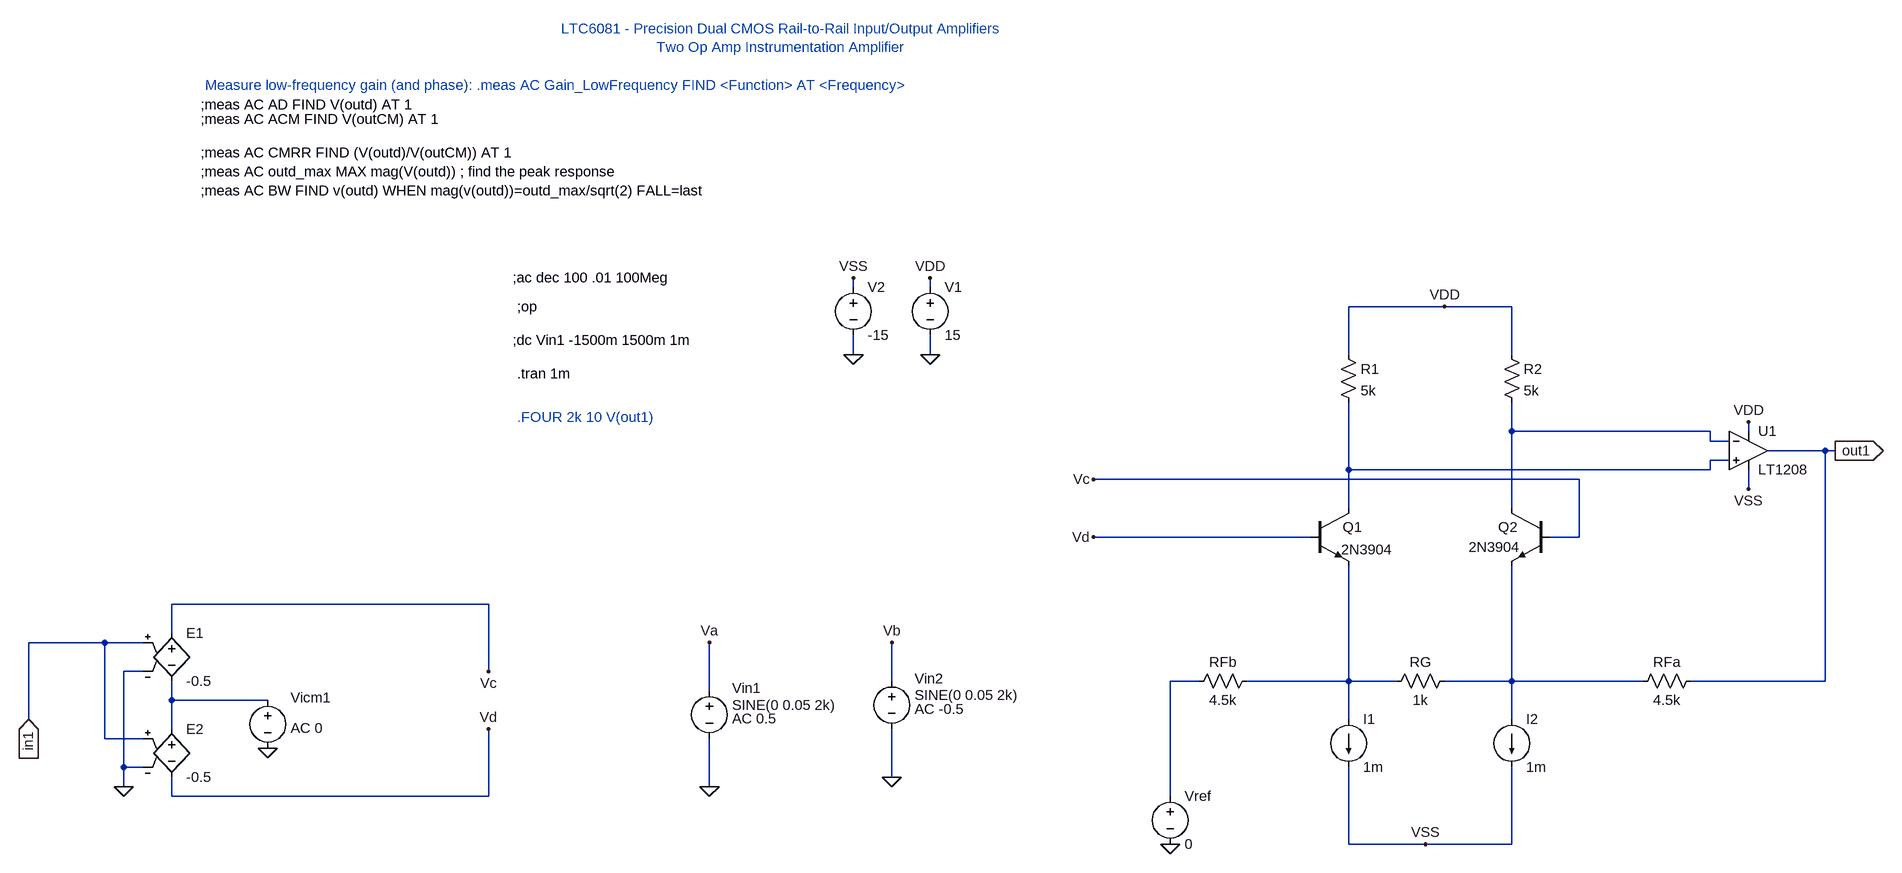
[diagram p0: schematic Etaj1.asc]
Etaj1.asc, the LTspice schematic file:
Version 4
SHEET 1 3624 1836
WIRE -3136 -272 -3136 -288
WIRE -3008 -272 -3008 -288
WIRE -2064 -240 -2224 -240
WIRE -1952 -240 -2064 -240
WIRE -3136 -160 -3136 -192
WIRE -3008 -160 -3008 -192
WIRE -2224 -160 -2224 -240
WIRE -1952 -160 -1952 -240
WIRE -1952 -32 -1952 -80
WIRE -1488 -32 -1952 -32
WIRE -1424 -32 -1424 -48
WIRE -1488 -16 -1488 -32
WIRE -1456 -16 -1488 -16
WIRE -1296 0 -1392 0
WIRE -1280 0 -1296 0
WIRE -1456 16 -1488 16
WIRE -2224 32 -2224 -80
WIRE -1488 32 -1488 16
WIRE -1488 32 -2224 32
WIRE -1840 48 -2736 48
WIRE -1424 64 -1424 32
WIRE -2224 96 -2224 32
WIRE -1952 96 -1952 -32
WIRE -2288 144 -2736 144
WIRE -1840 144 -1840 48
WIRE -1840 144 -1888 144
WIRE -3744 256 -4272 256
WIRE -4272 304 -4272 256
WIRE -4384 320 -4512 320
WIRE -4320 320 -4384 320
WIRE -4320 368 -4352 368
WIRE -3744 368 -3744 256
WIRE -3072 384 -3072 320
WIRE -2560 384 -2608 384
WIRE -2224 384 -2224 192
WIRE -2224 384 -2480 384
WIRE -2144 384 -2224 384
WIRE -1952 384 -1952 192
WIRE -1952 384 -2064 384
WIRE -1600 384 -1952 384
WIRE -1296 384 -1296 0
WIRE -1296 384 -1520 384
WIRE -3376 400 -3376 320
WIRE -4272 416 -4272 384
WIRE -4112 416 -4272 416
WIRE -4512 448 -4512 320
WIRE -2224 448 -2224 384
WIRE -1952 448 -1952 384
WIRE -4272 464 -4272 416
WIRE -4384 480 -4384 320
WIRE -4320 480 -4384 480
WIRE -4352 528 -4352 368
WIRE -4320 528 -4352 528
WIRE -3072 544 -3072 464
WIRE -4352 560 -4352 528
WIRE -3376 560 -3376 480
WIRE -4272 576 -4272 544
WIRE -3744 576 -3744 464
WIRE -3744 576 -4272 576
WIRE -2608 576 -2608 384
WIRE -2224 656 -2224 528
WIRE -2096 656 -2224 656
WIRE -1952 656 -1952 528
WIRE -1952 656 -2096 656
FLAG -3008 -160 0
FLAG -3008 -288 VDD
FLAG -3136 -160 0
FLAG -3136 -288 VSS
FLAG -1424 -48 VDD
FLAG -1424 64 VSS
FLAG -2064 -240 VDD
FLAG -2096 656 VSS
FLAG -3376 560 0
FLAG -3072 544 0
FLAG -2608 656 0
FLAG -3376 320 Va
FLAG -3072 320 Vb
FLAG -4352 560 0
FLAG -4112 496 0
FLAG -3744 368 Vc
FLAG -3744 464 Vd
FLAG -2736 48 Vc
FLAG -2736 144 Vd
FLAG -4512 448 in1
IOPIN -4512 448 In
FLAG -1280 0 out1
IOPIN -1280 0 Out
DATAFLAG -2224 -32 ""
DATAFLAG -1952 -48 ""
DATAFLAG -2224 336 ""
DATAFLAG -1952 304 ""
DATAFLAG -1296 112 ""
SYMBOL voltage -3008 -288 R0
WINDOW 123 0 0 Left 2
WINDOW 39 0 0 Left 2
SYMATTR InstName V1
SYMATTR Value 15
SYMBOL voltage -3136 -288 R0
WINDOW 123 0 0 Left 2
WINDOW 39 0 0 Left 2
SYMATTR InstName V2
SYMATTR Value -15
SYMBOL npn -2288 96 R0
WINDOW 0 54 32 Left 2
WINDOW 3 52 69 Left 2
SYMATTR InstName Q1
SYMATTR Value 2N3904
SYMBOL npn -1888 96 M0
WINDOW 0 54 32 Left 2
WINDOW 3 51 65 Left 2
SYMATTR InstName Q2
SYMATTR Value 2N3904
SYMBOL res -2240 -176 R0
SYMATTR InstName R1
SYMATTR Value 5k
SYMBOL res -1968 -176 R0
SYMATTR InstName R2
SYMATTR Value 5k
SYMBOL res -1504 368 R90
WINDOW 0 0 56 VBottom 2
WINDOW 3 32 56 VTop 2
SYMATTR InstName RFa
SYMATTR Value 4.5k
SYMBOL res -2048 368 R90
WINDOW 0 0 56 VBottom 2
WINDOW 3 32 56 VTop 2
SYMATTR InstName RG
SYMATTR Value 1k
SYMBOL res -2464 368 R90
WINDOW 0 0 56 VBottom 2
WINDOW 3 32 56 VTop 2
SYMATTR InstName RFb
SYMATTR Value 4.5k
SYMBOL current -2224 448 R0
WINDOW 123 0 0 Left 0
WINDOW 39 0 0 Left 0
SYMATTR InstName I1
SYMATTR Value 1m
SYMBOL current -1952 448 R0
WINDOW 123 0 0 Left 0
WINDOW 39 0 0 Left 0
SYMATTR InstName I2
SYMATTR Value 1m
SYMBOL voltage -3376 384 R0
WINDOW 123 38 63 Left 2
WINDOW 39 0 0 Left 2
WINDOW 0 38 12 Left 2
WINDOW 3 38 40 Left 2
SYMATTR Value2 AC 0.5
SYMATTR InstName Vin1
SYMATTR Value SINE(0 0.05 2k)
SYMBOL OpAmps\\LT1208 -1424 -64 R0
SYMATTR InstName U1
SYMBOL voltage -3072 368 R0
WINDOW 123 38 63 Left 2
WINDOW 39 0 0 Left 2
WINDOW 0 38 12 Left 2
WINDOW 3 38 40 Left 2
SYMATTR Value2 AC -0.5
SYMATTR InstName Vin2
SYMATTR Value SINE(0 0.05 2k)
SYMBOL voltage -2608 560 R0
WINDOW 123 0 0 Left 0
WINDOW 39 0 0 Left 0
SYMATTR InstName Vref
SYMATTR Value 0
SYMBOL e -4272 288 R0
SYMATTR InstName E1
SYMATTR Value -0.5
SYMBOL e -4272 448 R0
SYMATTR InstName E2
SYMATTR Value -0.5
SYMBOL voltage -4112 400 R0
WINDOW 123 38 63 Left 2
WINDOW 39 0 0 Left 2
WINDOW 0 38 12 Left 2
WINDOW 3 -188 38 Left 2
SYMATTR Value2 AC 0
SYMATTR InstName Vicm1
SYMATTR Value ""
TEXT -3704 -288 Left 2 !;ac dec 100 .01 100Meg
TEXT -4224 -1200 Left 2 !;meas AC AD FIND V(outd) AT 1
TEXT -4216 -1232 Left 2 ;Measure low-frequency gain (and phase): .meas AC Gain_LowFrequency FIND <Function> AT <Frequency>
TEXT -4224 -1176 Left 2 !;meas AC ACM FIND V(outCM) AT 1
TEXT -4224 -1120 Left 2 !;meas AC CMRR FIND (V(outd)/V(outCM)) AT 1
TEXT -3256 -1280 Bottom 2 ;LTC6081 - Precision Dual CMOS Rail-to-Rail Input/Output Amplifiers\nTwo Op Amp Instrumentation Amplifier
TEXT -4224 -1088 Left 2 !;meas AC outd_max MAX mag(V(outd)) ; find the peak response\n;meas AC BW FIND v(outd) WHEN mag(v(outd))=outd_max/sqrt(2) FALL=last
TEXT -3696 -240 Left 2 !;op
TEXT -3704 -184 Left 2 !;dc Vin1 -1500m 1500m 1m
TEXT -3696 -128 Left 2 !.tran 1m
TEXT -3696 -56 Left 2 ;.FOUR 2k 10 V(out1)

The netlist it stands for:
* Etaj1.asc
V1 VDD 0 15
V2 VSS 0 -15
Q1 N002 Vd N004 0 2N3904
Q2 N001 Vc N005 0 2N3904
R1 VDD N002 5k
R2 VDD N001 5k
RFa out1 N005 4.5k
RG N005 N004 1k
RFb N004 N003 4.5k
I1 N004 VSS 1m
I2 N005 VSS 1m
Vin1 Va 0 SINE(0 0.05 2k) AC 0.5
XU1 N002 N001 VDD VSS out1 LT1208  ; pins In+ In- V+ V- OUT
Vin2 Vb 0 SINE(0 0.05 2k) AC -0.5
Vref N003 0 0
E1 Vc N006 in1 0 -0.5
E2 N006 Vd in1 0 -0.5
Vicm1 N006 0 AC 0
.model NPN NPN
.model PNP PNP
.lib standard.bjt
;ac dec 100 .01 100Meg
;meas AC AD FIND V(outd) AT 1
* Measure low-frequency gain (and phase): .meas AC Gain_LowFrequency FIND <Function> AT <Frequency>
;meas AC ACM FIND V(outCM) AT 1
;meas AC CMRR FIND (V(outd)/V(outCM)) AT 1
* LTC6081 - Precision Dual CMOS Rail-to-Rail Input/Output Amplifiers
* Two Op Amp Instrumentation Amplifier
;meas AC outd_max MAX mag(V(outd)) ; find the peak response
;meas AC BW FIND v(outd) WHEN mag(v(outd))=outd_max/sqrt(2) FALL=last
;op
;dc Vin1 -1500m 1500m 1m
.tran 1m
* .FOUR 2k 10 V(out1)
.backanno
.end